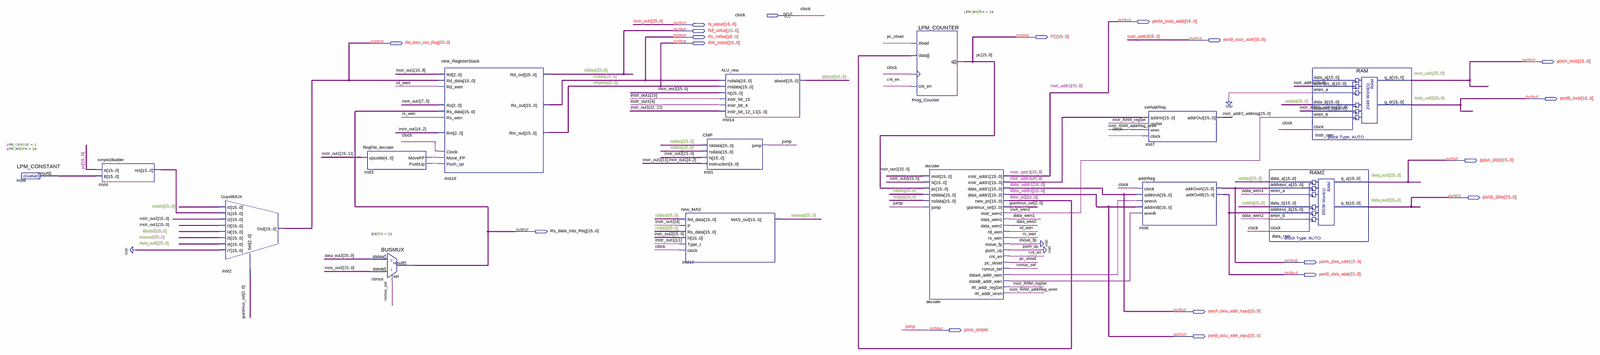
[diagram p0: schematic sheet, whole]
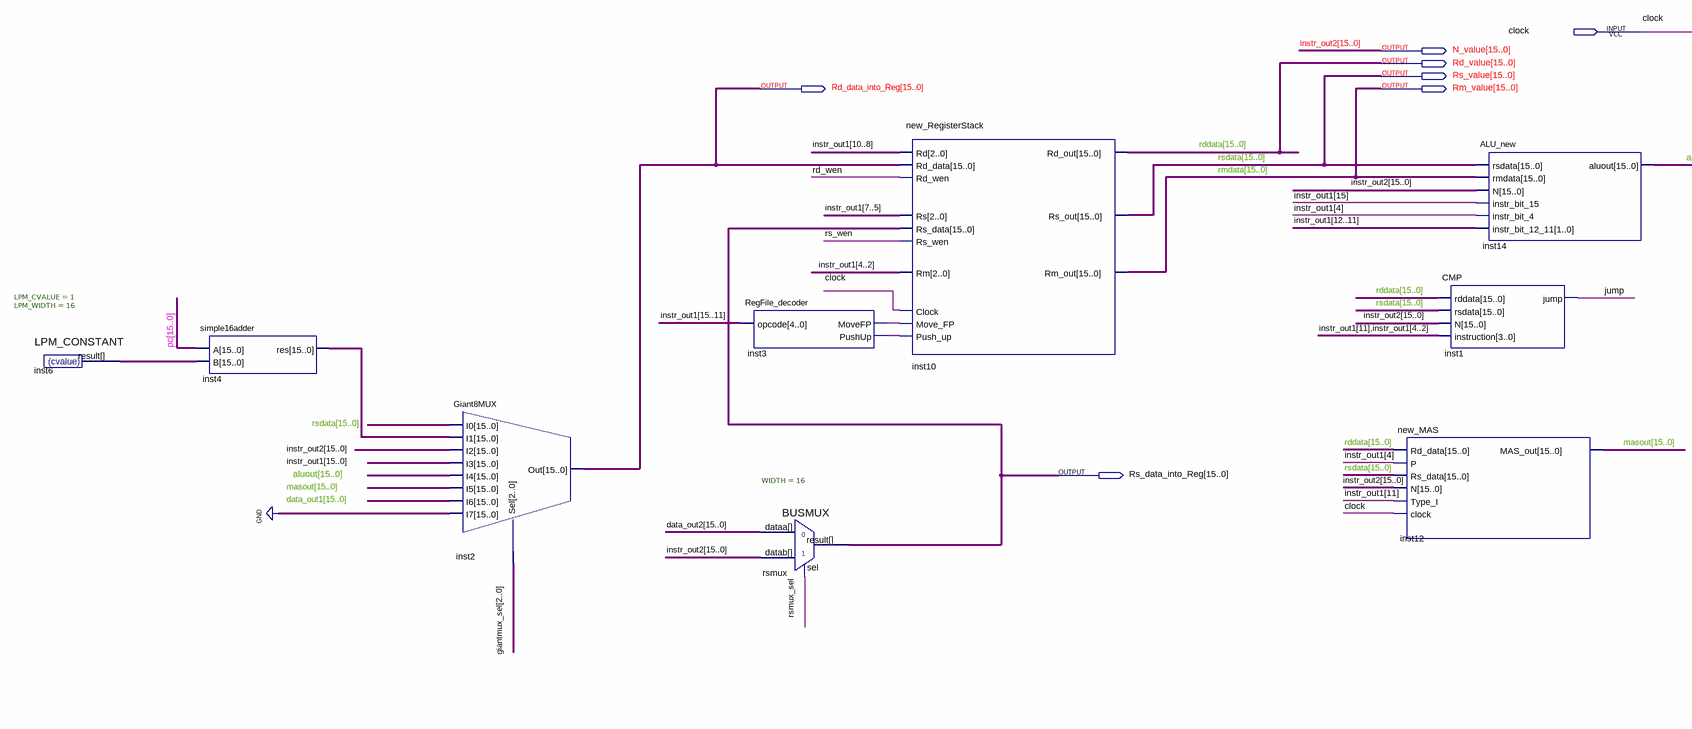
[diagram p1: schematic sheet, left part]
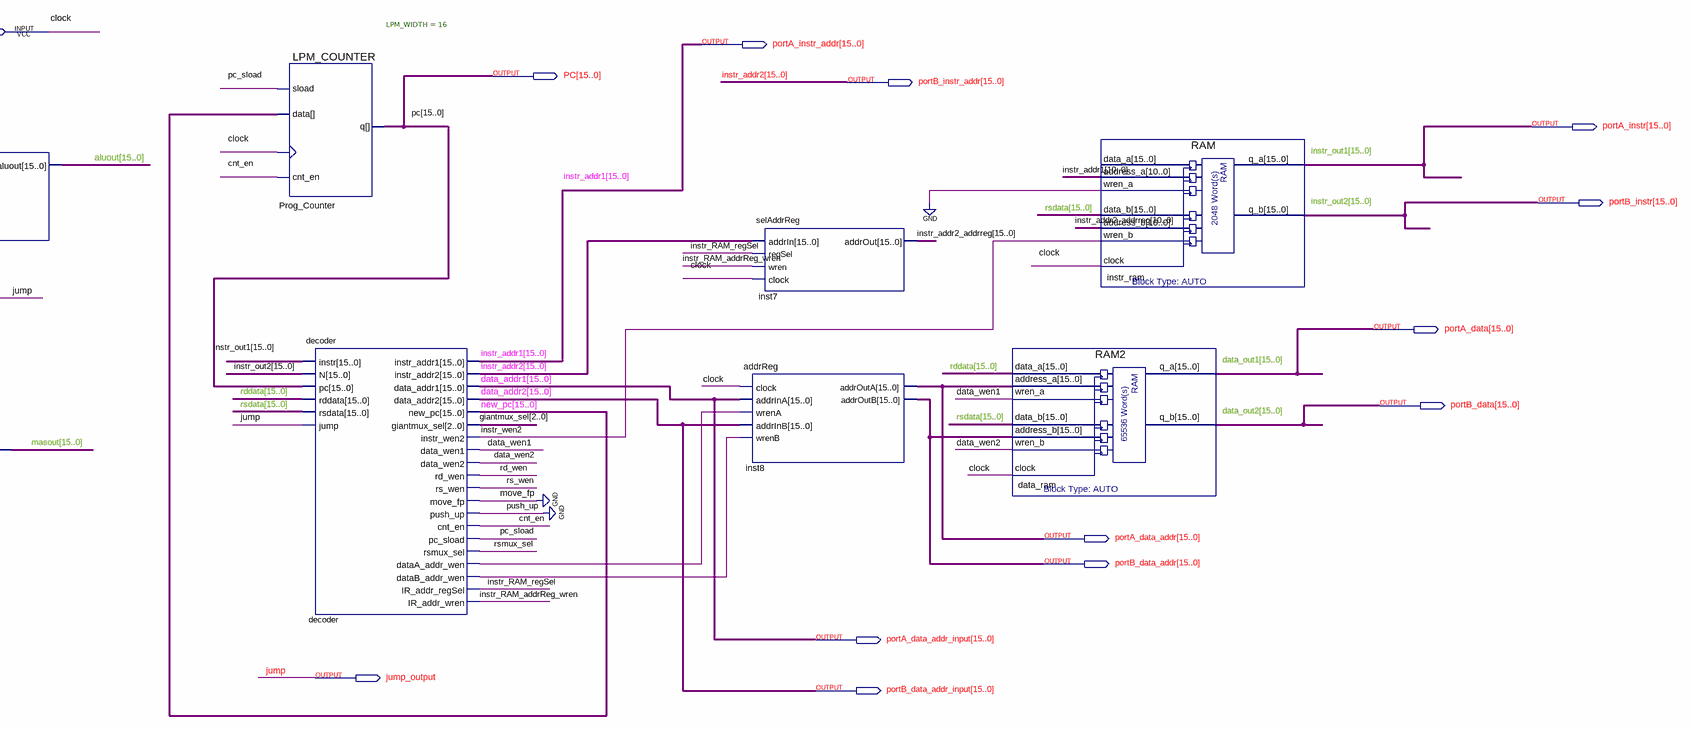
[diagram p2: schematic sheet, right part]
// Quartus schematic Main_CPU.bdf as structural Verilog: 15 symbols, 19 pins
module Main_CPU (
  input  clock,
  output [15:0] portA_instr_addr,
  output [15:0] N_value,
  output [15:0] Rd_value,
  output [15:0] Rs_value,
  output [15:0] PC,
  output [15:0] portB_instr_addr,
  output [15:0] Rd_data_into_Reg,
  output [15:0] Rm_value,
  output [15:0] portA_instr,
  output [15:0] portB_instr,
  output [15:0] portA_data,
  output [15:0] portB_data,
  output [15:0] Rs_data_into_Reg,
  output [15:0] portA_data_addr,
  output [15:0] portB_data_addr,
  output [15:0] portA_data_addr_input,
  output jump_output,
  output [15:0] portB_data_addr_input
);

  wire cnt_en, data_wen1, data_wen2, decoder_dataa_addr_wen, decoder_datab_addr_wen, inst3_movefp,
       inst3_pushup, instr_RAM_addrReg_wren, instr_RAM_regSel, instr_wen2, move_fp, pc_sload, push_up,
       rd_wen, rs_wen, rsmux_sel;
  wire [2:0] giantmux_sel;
  wire [15:0] aluout, inst4_res, inst6_result, instr_addr2_addrreg, masout, new_pc;

  LPM_CONSTANT #(.LPM_CVALUE(1), .LPM_WIDTH(16)) inst6 (.result(inst6_result));
  simple16adder inst4 (.A(PC), .B(inst6_result), .res(inst4_res));
  Giant8MUX inst2 (
    .I0(Rs_value), .I1(inst4_res), .I2(N_value), .I3(portA_instr), .I4(aluout), .I5(masout), .I6(portA_data),
    .I7({16{1'b0}}), .Sel(giantmux_sel), .Out(Rd_data_into_Reg));
  RegFile_decoder inst3 (.opcode(portA_instr[15:11]), .MoveFP(inst3_movefp), .PushUp(inst3_pushup));
  BUSMUX #(.WIDTH(16)) rsmux (.datab(N_value), .sel(rsmux_sel), .dataa(portB_data), .result(Rs_data_into_Reg));
  new_RegisterStack inst10 (
    .Clock(clock), .Move_FP(inst3_movefp), .Rd_wen(rd_wen), .Rd(portA_instr[10:8]), .Rs_wen(rs_wen),
    .Rd_data(Rd_data_into_Reg), .Rs_data(Rs_data_into_Reg), .Rs(portA_instr[7:5]), .Push_up(inst3_pushup),
    .Rm(portA_instr[4:2]), .Rd_out(Rd_value), .Rs_out(Rs_value), .Rm_out(Rm_value));
  new_MAS inst12 (
    .Rd_data(Rd_value), .P(portA_instr[4]), .Rs_data(Rs_value), .N(N_value), .Type_I(portA_instr[11]),
    .clock(clock), .MAS_out(masout));
  CMP inst1 (
    .rddata(Rd_value), .rsdata(Rs_value), .N(N_value), .instruction({portA_instr[11], portA_instr[4:2]}),
    .jump(jump_output));
  ALU_new inst14 (
    .rsdata(Rs_value), .rmdata(Rm_value), .N(N_value), .instr_bit_15(portA_instr[15]),
    .instr_bit_4(portA_instr[4]), .instr_bit_12_11(portA_instr[12:11]), .aluout(aluout));
  LPM_COUNTER #(.LPM_WIDTH(16)) Prog_Counter (.sload(pc_sload), .data(new_pc), .clock(clock), .cnt_en(cnt_en), .q(PC));
  decoder decoder (
    .instr(portA_instr), .N(N_value), .pc(PC), .rddata(Rd_value), .rsdata(Rs_value), .jump(jump_output),
    .instr_addr1(portA_instr_addr), .instr_addr2(portB_instr_addr), .data_addr1(portA_data_addr_input),
    .data_addr2(portB_data_addr_input), .new_pc(new_pc), .giantmux_sel(giantmux_sel),
    .instr_wen2(instr_wen2), .data_wen1(data_wen1), .data_wen2(data_wen2), .rd_wen(rd_wen), .rs_wen(rs_wen),
    .move_fp(move_fp), .push_up(push_up), .cnt_en(cnt_en), .pc_sload(pc_sload), .rsmux_sel(rsmux_sel),
    .dataA_addr_wen(decoder_dataa_addr_wen), .dataB_addr_wen(decoder_datab_addr_wen),
    .IR_addr_regSel(instr_RAM_regSel), .IR_addr_wren(instr_RAM_addrReg_wren));
  selAddrReg inst7 (
    .addrIn(portB_instr_addr), .regSel(instr_RAM_regSel), .wren(instr_RAM_addrReg_wren), .clock(clock),
    .addrOut(instr_addr2_addrreg));
  addrReg inst8 (
    .clock(clock), .addrInA(portA_data_addr_input), .wrenA(decoder_dataa_addr_wen),
    .addrInB(portB_data_addr_input), .wrenB(decoder_datab_addr_wen), .addrOutA(portA_data_addr),
    .addrOutB(portB_data_addr));
  RAM2 data_ram (
    .data_a(Rd_value), .address_a(portA_data_addr), .wren_a(data_wen1), .data_b(Rs_value),
    .address_b(portB_data_addr), .wren_b(data_wen2), .clock(clock), .q_a(portA_data), .q_b(portB_data));
  RAM instr_ram (
    .address_a(portA_instr_addr[10:0]), .wren_a(1'b0), .data_b(Rs_value),
    .address_b(instr_addr2_addrreg[10:0]), .wren_b(instr_wen2), .clock(clock), .q_a(portA_instr),
    .q_b(N_value));  // open: data_a

  assign portB_instr = N_value;
  // also tied to GND on the sheet: {move_fp, push_up}

  // Other names for the same wires on the sheet: data_out1[15:0] = portA_data; data_out2[15:0] = portB_data;
  //   instr_addr2[15:0] = portB_instr_addr; jump = jump_output; data_addr1[15:0] = portA_data_addr_input;
  //   instr_out1[15:0] = portA_instr; instr_addr1[15:0] = portA_instr_addr; data_addr2[15:0] = portB_data_addr_input;
  //   instr_out2[15:0] = N_value; rddata[15:0] = Rd_value; rmdata[15:0] = Rm_value; rsdata[15:0] = Rs_value
endmodule
